# Altium schematic sheet sd2snes.SchDoc
size A
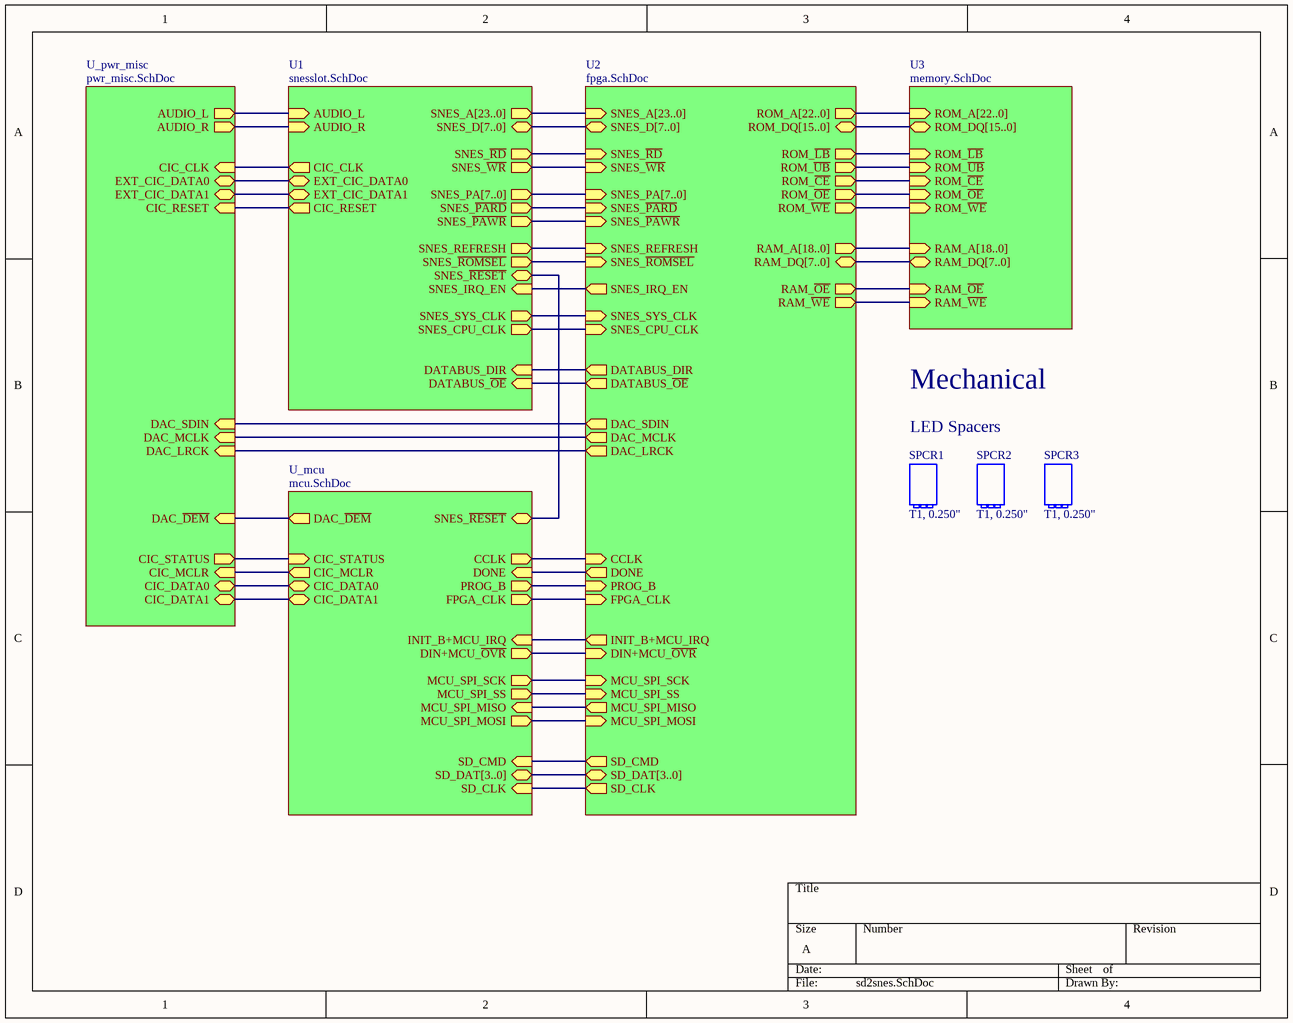
[diagram p0: sd2snes.SchDoc]

## Parts
SPCR1  T1, 0.250"  (mechanical)
SPCR2  T1, 0.250"  (mechanical)
SPCR3  T1, 0.250"  (mechanical)

## Sub-sheets
U1 = snesslot.SchDoc: SNES_~{PARD} (out), SNES_~{PAWR} (out), SNES_REFRESH (out), SNES_SYS_CLK (out), SNES_~{RD} (out), SNES_~{ROMSEL} (out), SNES_IRQ_EN (in), SNES_~{RESET} (bidir), EXT_CIC_DATA1 (bidir), EXT_CIC_DATA0 (bidir), CIC_CLK (out), CIC_RESET (out), AUDIO_L (in), AUDIO_R (in), SNES_~{WR} (out), SNES_CPU_CLK (out), DATABUS_~{OE} (in), DATABUS_DIR (in), SNES_D[7..0] (bidir), SNES_A[23..0] (out), SNES_PA[7..0] (out)
U2 = fpga.SchDoc: ROM_~{WE} (out), ROM_~{OE} (out), ROM_~{UB} (out), ROM_~{CE} (out), SNES_SYS_CLK (in), ROM_~{LB} (out), SNES_REFRESH (in), SNES_~{PAWR} (in), SNES_~{PARD} (in), SNES_~{ROMSEL} (in), SNES_~{RD} (in), SNES_IRQ_EN (out), DATABUS_DIR (out), DATABUS_~{OE} (out), FPGA_CLK (in), INIT_B+MCU_IRQ (out), DIN+MCU_~{OVR} (in), SNES_~{WR} (in), SNES_CPU_CLK (in), MCU_SPI_SCK (in), DAC_SDIN (out), SD_CLK (out), MCU_SPI_SS (in), SD_CMD (out), MCU_SPI_MOSI (in), MCU_SPI_MISO (out), DAC_LRCK (out), DAC_MCLK (out), RAM_~{WE} (out), RAM_~{OE} (out), PROG_B (in), DONE (out), CCLK (in), ROM_A[22..0] (out), RAM_DQ[7..0] (bidir), ROM_DQ[15..0] (bidir), RAM_A[18..0] (out), SD_DAT[3..0] (bidir), SNES_PA[7..0] (in), SNES_D[7..0] (bidir), SNES_A[23..0] (in)
U3 = memory.SchDoc: ROM_~{CE} (in), ROM_~{OE} (in), ROM_~{WE} (in), ROM_A[22..0] (in), ROM_~{LB} (in), ROM_~{UB} (in), ROM_DQ[15..0] (bidir), RAM_A[18..0] (in), RAM_DQ[7..0] (bidir), RAM_~{OE} (in), RAM_~{WE} (in)
U_mcu = mcu.SchDoc: INIT_B+MCU_IRQ (in), DIN+MCU_~{OVR} (out), SNES_~{RESET} (bidir), CIC_STATUS (in), CIC_MCLR (out), DAC_~{DEM} (out), PROG_B (out), DONE (in), MCU_SPI_MOSI (out), MCU_SPI_MISO (in), MCU_SPI_SS (out), MCU_SPI_SCK (out), CCLK (out), FPGA_CLK (out), CIC_DATA1 (bidir), CIC_DATA0 (bidir), SD_DAT[3..0] (bidir), SD_CMD (in), SD_CLK (in)
U_pwr_misc = pwr_misc.SchDoc: CIC_CLK (in), CIC_STATUS (out), CIC_MCLR (in), CIC_DATA0 (bidir), CIC_DATA1 (bidir), EXT_CIC_DATA0 (bidir), EXT_CIC_DATA1 (bidir), CIC_RESET (in), DAC_SDIN (in), DAC_~{DEM} (in), DAC_LRCK (in), DAC_MCLK (in), AUDIO_R (out), AUDIO_L (out)

## Nets
(unnamed): sheet U1/SNES_~{PARD}, sheet U2/SNES_~{PARD}
(unnamed): sheet U1/SNES_~{PAWR}, sheet U2/SNES_~{PAWR}
(unnamed): sheet U1/SNES_REFRESH, sheet U2/SNES_REFRESH
(unnamed): sheet U1/SNES_SYS_CLK, sheet U2/SNES_SYS_CLK
(unnamed): sheet U1/SNES_~{RD}, sheet U2/SNES_~{RD}
(unnamed): sheet U1/SNES_~{ROMSEL}, sheet U2/SNES_~{ROMSEL}
(unnamed): sheet U1/SNES_IRQ_EN, sheet U2/SNES_IRQ_EN
(unnamed): sheet U1/SNES_~{RESET}, sheet U_mcu/SNES_~{RESET}
(unnamed): sheet U1/EXT_CIC_DATA1, sheet U_pwr_misc/EXT_CIC_DATA1
(unnamed): sheet U1/EXT_CIC_DATA0, sheet U_pwr_misc/EXT_CIC_DATA0
(unnamed): sheet U1/CIC_CLK, sheet U_pwr_misc/CIC_CLK
(unnamed): sheet U1/CIC_RESET, sheet U_pwr_misc/CIC_RESET
(unnamed): sheet U1/AUDIO_L, sheet U_pwr_misc/AUDIO_L
(unnamed): sheet U1/AUDIO_R, sheet U_pwr_misc/AUDIO_R
(unnamed): sheet U1/SNES_~{WR}, sheet U2/SNES_~{WR}
(unnamed): sheet U1/SNES_CPU_CLK, sheet U2/SNES_CPU_CLK
(unnamed): sheet U1/DATABUS_~{OE}, sheet U2/DATABUS_~{OE}
(unnamed): sheet U1/DATABUS_DIR, sheet U2/DATABUS_DIR
(unnamed): sheet U2/ROM_~{WE}, sheet U3/ROM_~{WE}
(unnamed): sheet U2/ROM_~{OE}, sheet U3/ROM_~{OE}
(unnamed): sheet U2/ROM_~{UB}, sheet U3/ROM_~{UB}
(unnamed): sheet U2/ROM_~{CE}, sheet U3/ROM_~{CE}
(unnamed): sheet U2/ROM_~{LB}, sheet U3/ROM_~{LB}
(unnamed): sheet U2/FPGA_CLK, sheet U_mcu/FPGA_CLK
(unnamed): sheet U2/INIT_B+MCU_IRQ, sheet U_mcu/INIT_B+MCU_IRQ
(unnamed): sheet U2/DIN+MCU_~{OVR}, sheet U_mcu/DIN+MCU_~{OVR}
(unnamed): sheet U2/MCU_SPI_SCK, sheet U_mcu/MCU_SPI_SCK
(unnamed): sheet U2/DAC_SDIN, sheet U_pwr_misc/DAC_SDIN
(unnamed): sheet U2/SD_CLK, sheet U_mcu/SD_CLK
(unnamed): sheet U2/MCU_SPI_SS, sheet U_mcu/MCU_SPI_SS
(unnamed): sheet U2/SD_CMD, sheet U_mcu/SD_CMD
(unnamed): sheet U2/MCU_SPI_MOSI, sheet U_mcu/MCU_SPI_MOSI
(unnamed): sheet U2/MCU_SPI_MISO, sheet U_mcu/MCU_SPI_MISO
(unnamed): sheet U2/DAC_LRCK, sheet U_pwr_misc/DAC_LRCK
(unnamed): sheet U2/DAC_MCLK, sheet U_pwr_misc/DAC_MCLK
(unnamed): sheet U2/RAM_~{WE}, sheet U3/RAM_~{WE}
(unnamed): sheet U2/RAM_~{OE}, sheet U3/RAM_~{OE}
(unnamed): sheet U2/PROG_B, sheet U_mcu/PROG_B
(unnamed): sheet U2/DONE, sheet U_mcu/DONE
(unnamed): sheet U2/CCLK, sheet U_mcu/CCLK
(unnamed): sheet U_mcu/CIC_STATUS, sheet U_pwr_misc/CIC_STATUS
(unnamed): sheet U_mcu/CIC_MCLR, sheet U_pwr_misc/CIC_MCLR
(unnamed): sheet U_mcu/DAC_~{DEM}, sheet U_pwr_misc/DAC_~{DEM}
(unnamed): sheet U_mcu/CIC_DATA1, sheet U_pwr_misc/CIC_DATA1
(unnamed): sheet U_mcu/CIC_DATA0, sheet U_pwr_misc/CIC_DATA0

## Buses and harness runs
bus sheet U1/SNES_A[23..0] = sheet U2/SNES_A[23..0]
bus sheet U1/SNES_D[7..0] = sheet U2/SNES_D[7..0]
bus sheet U1/SNES_PA[7..0] = sheet U2/SNES_PA[7..0]
bus sheet U2/RAM_A[18..0] = sheet U3/RAM_A[18..0]
bus sheet U2/RAM_DQ[7..0] = sheet U3/RAM_DQ[7..0]
bus sheet U2/ROM_A[22..0] = sheet U3/ROM_A[22..0]
bus sheet U2/ROM_DQ[15..0] = sheet U3/ROM_DQ[15..0]
bus sheet U2/SD_DAT[3..0] = sheet U_mcu/SD_DAT[3..0]

## Notes on the sheet
- Mechanical
- LED Spacers

## Library data of the parts
SPCR1-SPCR3 = LED_SPACER: LED Spacer; Value: T1, 0.250"